# EasyEDA schematic Breadboard potentiometer adapter(with power).json
TITLE: Breadboard potentiometer adapter - with power; REV: 1.0; Date: 2021-12-11; Sheet: 1/1; Drawn By: philbobagins
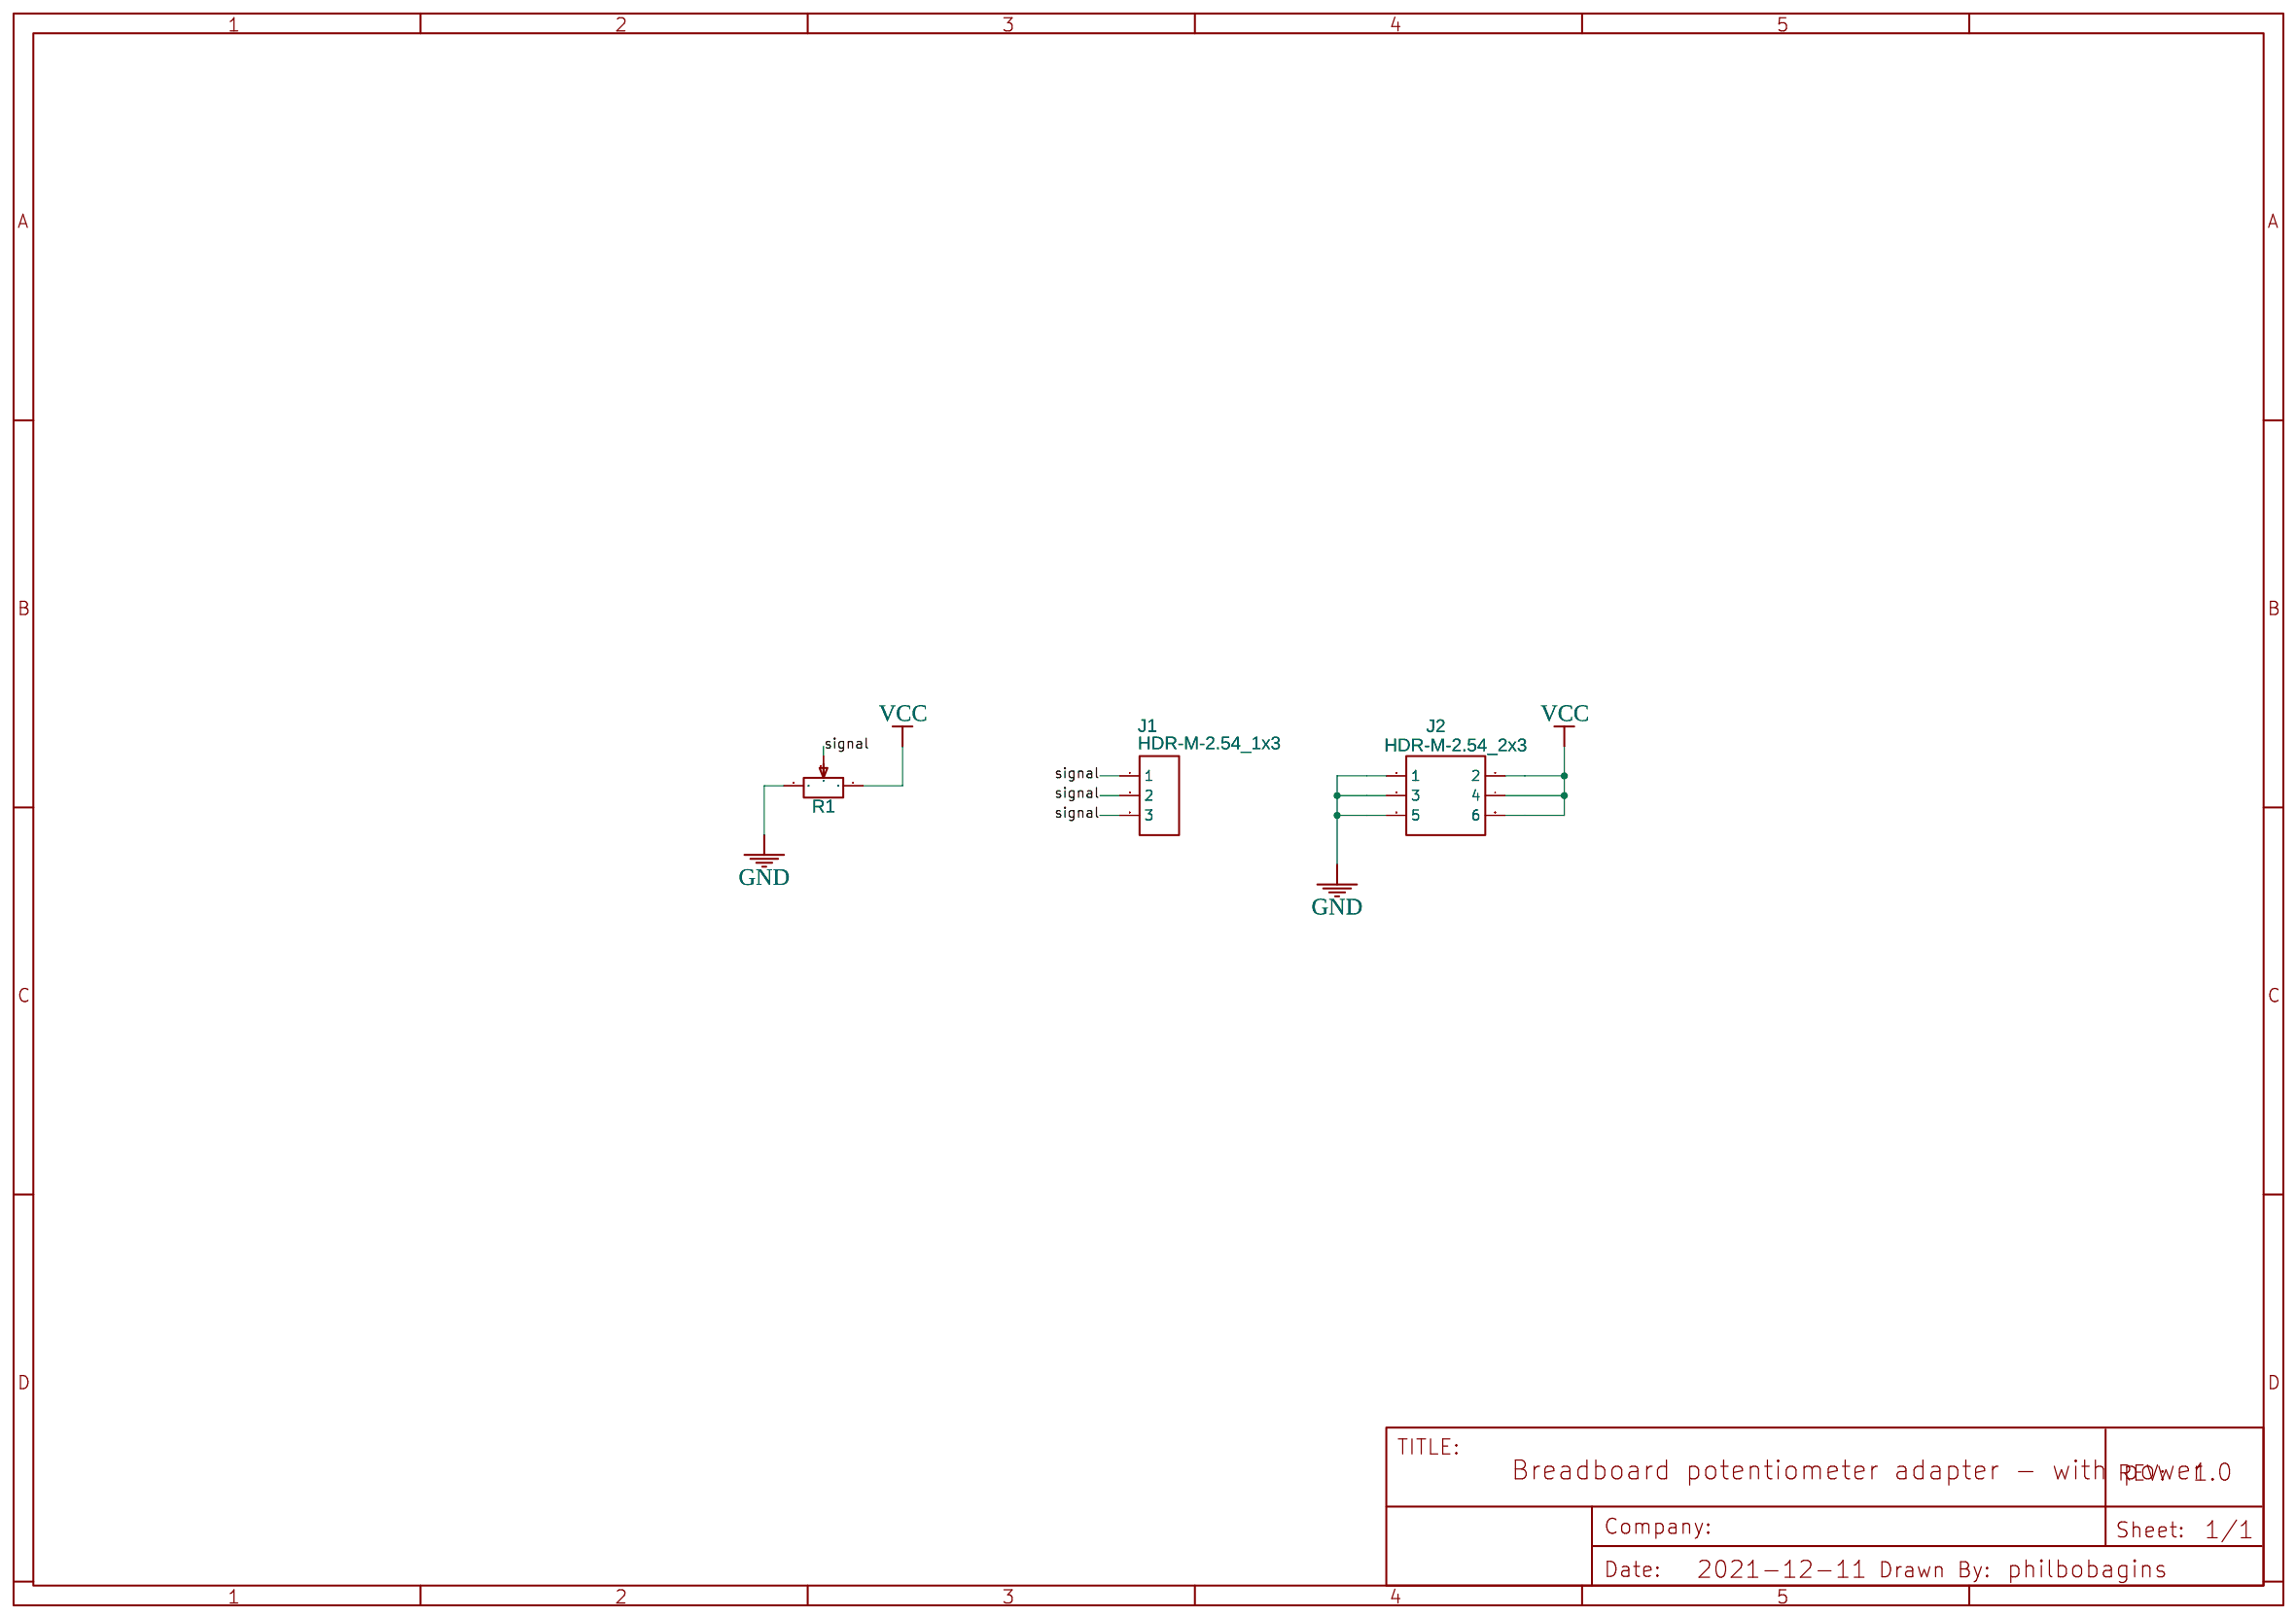
[diagram p0: schematic sheet]

## Parts
J1  HDR-M-2.54_1x3  [HDR-M-2.54_1X3]
J2  HDR-M-2.54_2x3  [HDR-M-2.54_2X3]
R1  ALPS  [RES-ADJ-TH_RK1631110TT3]

## Library data of the parts
J1 = HDR-M-2.54_1x3: Supplier Part: C180248; Supplier: LCSC; Contributor: LCEDA_Lib
J2 = HDR-M-2.54_2x3: Supplier Part: C65114; Supplier: LCSC; Contributor: LCEDA_Lib
R1 = RK1631110TT3: Supplier: LCSC; Supplier Part: C370977; Manufacturer: ALPS Electric; Contributor: LCSC; JLCPCB Part Class: Extended Part

## Nets
GND: J2.1 J2.3 J2.5 R1.3
VCC: J2.2 J2.4 J2.6 R1.1
signal: J1.1 J1.2 J1.3 R1.2
